# Altium schematic sheet 780-00041, rev1, Front Panel, Mirror Cell Controller.SchDoc
size B; PageSetup: Record=PageOptions|CenterHorizontal=True|CenterVertical=True|PrintScale=1.09|XCorrection=1.00|YCorrection=1.00|PrintKind=0|BorderSize=5000000|LeftOffset=0|BottomOffset=0|Orientation=2|PaperLength=1000|PaperWidth=1000|Scale=100|PaperSource=7|PrintQuality=-4|MediaType=1|DitherType=10|PaperKind=Tabloid 11 x 17in|PrintScaleMode=1
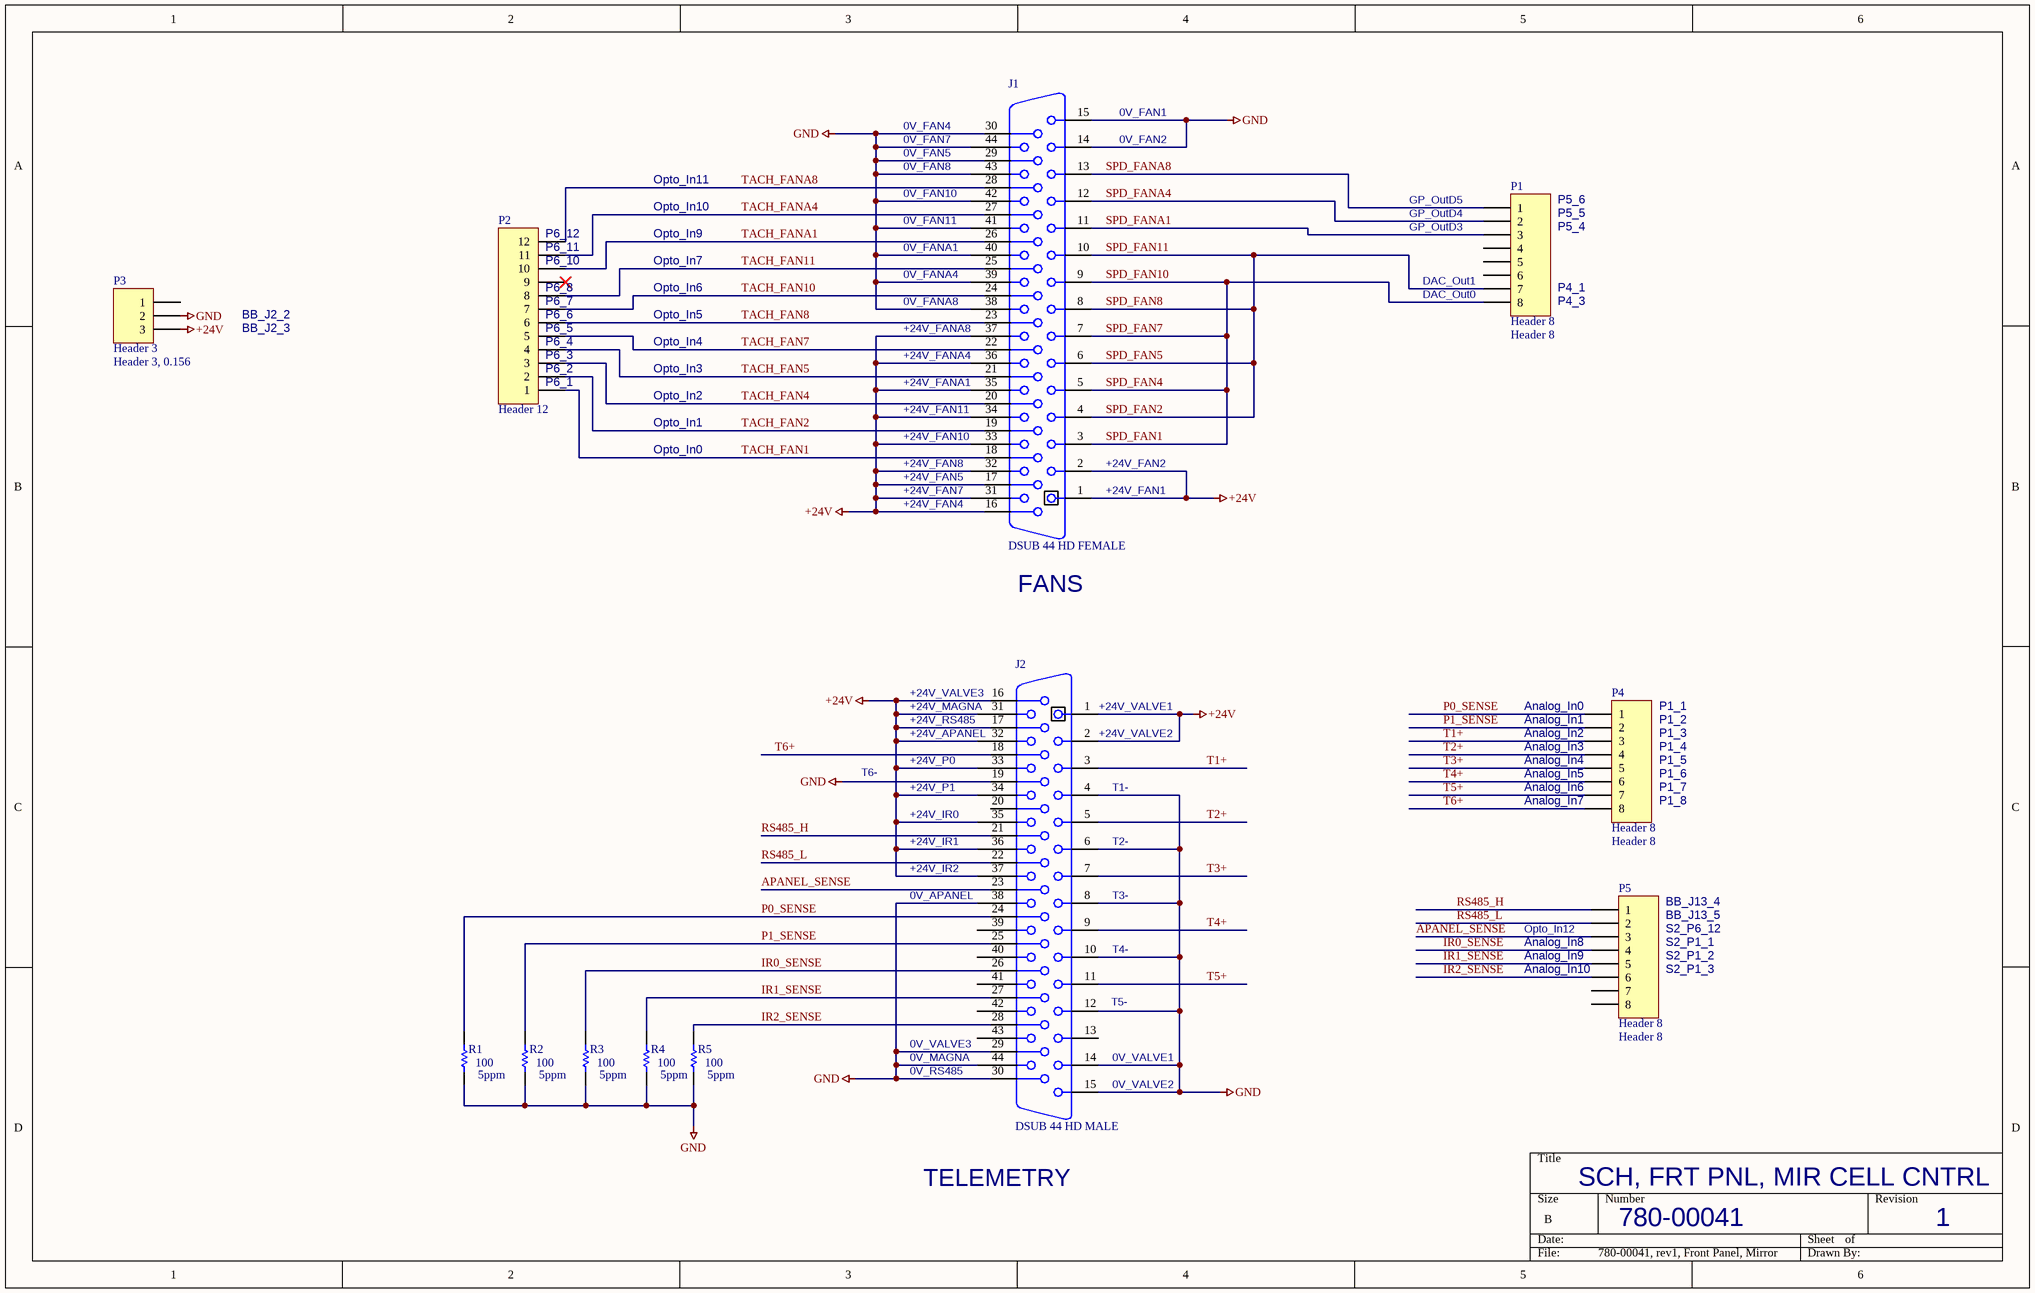
[diagram p0: 780-00041, rev1, Front Panel, Mirror Cell Controller.SchDoc]

## Parts
J1  DSUB 44 HD FEMALE  [CONN DB44 HD FEM SOCKETS PCB]
J2  DSUB 44 HD MALE  [CONN DB44 HD MALE PINS PCB]
P1  Header 8  [HDR1X8 for IDC]
P2  Header 12  [HDR1X12 for IDC]
P3  Header 3  value Header 3, 0.156  [HDR 1X3 0.156"]
P4  Header 8  [HDR1X8 for IDC]
P5  Header 8  [HDR1X8 for IDC]
R1  5ppm  value 100  [SMD_0805]
R2  5ppm  value 100  [SMD_0805]
R3  5ppm  value 100  [SMD_0805]
R4  5ppm  value 100  [SMD_0805]
R5  5ppm  value 100  [SMD_0805]

## Nets
+24V: J1.1 J1.2 J1.16 J1.17 J1.31 J1.32 J1.33 J1.34 J1.35 J1.36 J1.37 J2.1 J2.2 J2.16 J2.17 J2.31 J2.32 J2.33 J2.34 J2.35 J2.36 J2.37 P3.3
GND: J1.14 J1.15 J1.29 J1.30 J1.38 J1.39 J1.40 J1.41 J1.42 J1.43 J1.44 J2.4 J2.6 J2.8 J2.10 J2.12 J2.14 J2.15 J2.19 J2.29 J2.30 J2.38 J2.44 P3.2 R1.1 R2.1 R3.1 R4.1 R5.1
APANEL_SENSE: J2.23 P5.3
IR0_SENSE: J2.26 P5.4 R3.2
IR1_SENSE: J2.27 P5.5 R4.2
IR2_SENSE: J2.28 P5.6 R5.2
P0_SENSE: J2.24 P4.1 R1.2
P1_SENSE: J2.25 P4.2 R2.2
RS485_H: J2.21 P5.1
RS485_L: J2.22 P5.2
SPD_FAN1: J1.3 J1.5 J1.7 J1.9 P1.8  [also labelled SPD_FAN10, SPD_FAN4, SPD_FAN7]
SPD_FAN11: J1.4 J1.6 J1.8 J1.10 P1.7  [also labelled SPD_FAN2, SPD_FAN5, SPD_FAN8]
SPD_FANA1: J1.11 P1.3
SPD_FANA4: J1.12 P1.2
SPD_FANA8: J1.13 P1.1
T1+: J2.3 P4.3
T2+: J2.5 P4.4
T3+: J2.7 P4.5
T4+: J2.9 P4.6
T5+: J2.11 P4.7
T6+: J2.18 P4.8
TACH_FAN1: J1.18 P2.1
TACH_FAN2: J1.19 P2.2
TACH_FAN4: J1.20 P2.3
TACH_FAN5: J1.21 P2.4
TACH_FAN7: J1.22 P2.5
TACH_FAN8: J1.23 P2.6
TACH_FAN10: J1.24 P2.7
TACH_FAN11: J1.25 P2.8
TACH_FANA1: J1.26 P2.10
TACH_FANA4: J1.27 P2.11
TACH_FANA8: J1.28 P2.12

Not connected (* = marked no-connect by the designer): J2 13 20 39 40 41 42 43; P1 4 5 6; P2 9*; P3 1; P5 7 8

## Notes on the sheet
- 0V_FAN4
- 0V_FAN5
- 0V_FAN7
- 0V_FAN1
- 0V_FAN2
- (near P2) P6_12
- Opto_In9
- Opto_In10
- Opto_In11
- 0V_FAN8
- 0V_FAN10
- 0V_FAN11
- GP_OutD3
- GP_OutD4
- GP_OutD5
- (near P1) P5_4
- (near P1) P5_5
- (near P1) P5_6
- (near P2) P6_8
- (near P2) P6_10
- (near P2) P6_11
- Opto_In6
- Opto_In7
- 0V_FANA1
- 0V_FANA4
- (near P1) DAC_Out0
- (near P1) DAC_Out1
- (near P1) P4_1
- BB_J2_2
- BB_J2_3
- (near P2) P6_2
- (near P2) P6_3
- (near P2) P6_4
- (near P2) P6_5
- (near P2) P6_6
- (near P2) P6_7
- Opto_In3
- Opto_In4
- Opto_In5
- (near J1) +24V_FANA4
- (near J1) +24V_FANA8
- 0V_FANA8
- (near P1) P4_3
- (near P2) P6_1
- Opto_In1
- Opto_In2
- (near J1) +24V_FAN11
- (near J1) +24V_FANA1
- Opto_In0
- +24V_FAN4
- +24V_FAN5
- +24V_FAN7
- +24V_FAN8
- (near J1) +24V_FAN10
- (near J1) +24V_FAN1
- (near J1) +24V_FAN2
- FANS
- (near J2) +24V_VALVE3
- T6-
- (near J2) +24V_RS485
- (near J2) +24V_MAGNA
- (near J2) +24V_APANEL
- +24V_P0
- (near J2) +24V_VALVE1
- (near J2) +24V_VALVE2
- (near P4) Analog_In0
- (near P4) Analog_In1
- (near P4) Analog_In2
- (near P4) Analog_In3
- (near P4) Analog_In4
- (near P4) Analog_In5
- (near P4) P1_1
- (near P4) P1_2
- (near P4) P1_3
- (near P4) P1_4
- (near P4) P1_5
- (near P4) P1_6
- +24V_P1
- +24V_IR0
- (near J2) T1-
- (near P4) Analog_In6
- (near P4) Analog_In7
- (near P4) P1_7
- (near P4) P1_8
- +24V_IR1
- +24V_IR2
- 0V_APANEL
- (near J2) T2-
- (near J2) T3-
- (near P5) BB_J13_4
- (near J2) T4-
- (near P5) Opto_In12
- (near P5) Analog_In8
- (near P5) Analog_In9
- (near P5) Analog_In10
- (near P5) S2_P6_12
- (near P5) S2_P1_1
- (near P5) S2_P1_2
- (near P5) S2_P1_3
- (near P5) BB_J13_5
- 0V_VALVE3
- (near J2) T5-
- 0V_RS485
- 0V_MAGNA
- (near J2) 0V_VALVE1
- (near J2) 0V_VALVE2
- TELEMETRY
- SCH, FRT PNL, MIR CELL CNTRL
- 780-00041
- 1

## Library data of the parts
J1 = DSUB 44 HD FEMALE: Receptacle Assembly, 44 PIN; Manufacturer: fci; Manuf p/n: 10090929-S444XLF; LCO p/n: 125-00126; Vendor: digi-key; Vendor p/n: 609-4035-ND
J2 = DSUB 44 HD MALE: Receptacle Assembly, 44 PIN; Manufacturer: FCI; Manuf p/n: 10090928-P444XLF; LCO p/n: 125-00127; Vendor: Digi-Key; Vendor p/n: 609-4030-ND
P1 P4 P5 = Header 8: Header, 8-Pin; Manufacturer: tyco; Manuf p/n: 640456-8; Vendor: digi-key; Vendor p/n: A1924-ND; LCO p/n: 125-00047; VALUE: Header 8
P2 = Header 12: Header, 12-Pin; Manufacturer: Tyco; Manuf p/n: 1-640456-2; Vendor: Digi-Key; Vendor p/n: A19475-ND; LCO p/n: 125-00055; COST: 0.57; VALUE: Header 12
P3 = Header 3, 0.156: Header, 3-Pin, 0.156; LCO p/n: 125-00083
R1-R5 = Res SMD: Resistor 0805; Manufacturer: Vishay/Dale; Manuf p/n: TNPU0805100RBZEN00; Vendor: DIGIKEY; Vendor p/n: TNP100BBCT-ND; Vendor Mult.: 10; LCO p/n: 180-00078; COST: 0.09